# EAGLE design m8-usb-i2c-smd (EAGLE 5.11)
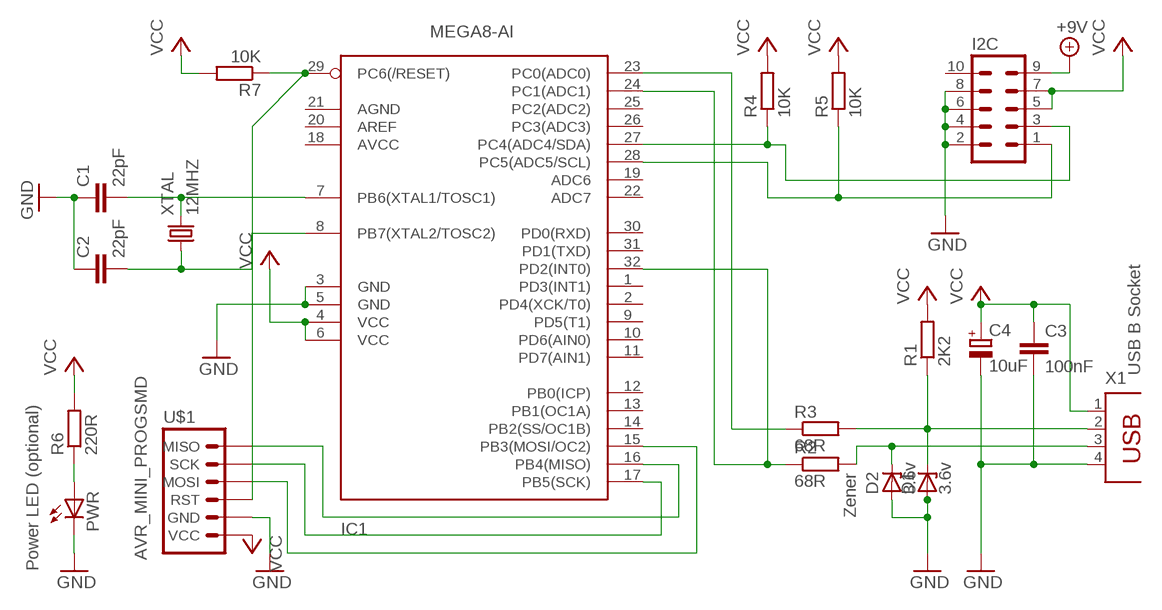
[diagram p0: schematic, sheet 1]

## Parts
C1  22pF  C-EUC1206  [C1206]
C2  22pF  C-EUC1206  [C1206]
C3  100nF  C-EUC1206  [C1206]
C4  10uF  CPOL-EUSMCC  [SMC_C]
D1  3.6v  ZENER-DIODESOT23  [SOT23]
D2  3.6v  ZENER-DIODESOT23  [SOT23]
I2C  ML10  [ML10]
IC1  MEGA8-AI  [TQFP32-08]
PWR  LEDCHIPLED_1206  [CHIPLED_1206]
R1  2K2  R-EU_R1206  [R1206]
R2  68R  R-EU_R1206  [R1206]
R3  68R  R-EU_R1206  [R1206]
R4  10K  R-EU_R1206  [R1206]
R5  10K  R-EU_R1206  [R1206]
R6  220R  R-EU_R1206  [R1206]
R7  10K  R-EU_R1206  [R1206]
U$1  AVR_MINI_PROGSMD  [AVR_MINI_PROG]
X1  PN61729  [PN61729]
XTAL  12MHZ  CRYSTALHC49S  [HC49/S]

## Nets
+9V: I2C.9
GND: C1.1 C2.1 C3.2 C4.- D1.1(A) D2.1(A) I2C.2 I2C.4 I2C.6 I2C.8 IC1.3(GND) IC1.5(GND) PWR.C U$1.2(GND) X1.4
MISO: IC1.16(PB4(MISO)) U$1.6(MISO)
MOSI: IC1.15(PB3(MOSI/OC2)) U$1.4(MOSI)
N$1: I2C.1 IC1.28(PC5(ADC5/SCL)) R5.1
N$2: D1.3(C) R1.1 R3.2 X1.2
N$3: IC1.29(PC6(/RESET)) R7.1 U$1.3(RST)
N$4: PWR.A R6.1
N$6: C2.2 IC1.8(PB7(XTAL2/TOSC2)) XTAL.1
N$7: C1.2 IC1.7(PB6(XTAL1/TOSC1)) XTAL.2
N$12: D2.3(C) R2.2 X1.3
SCL/SCK: IC1.17(PB5(SCK)) U$1.5(SCK)
SDA: I2C.3 IC1.27(PC4(ADC4/SDA)) R4.1
USB+: IC1.23(PC0(ADC0)) R3.1
USB-: IC1.24(PC1(ADC1)) IC1.32(PD2(INT0)) R2.1
VCC: C3.1 C4.+ I2C.5 I2C.7 IC1.4(VCC) IC1.6(VCC) R1.2 R4.2 R5.2 R6.2 R7.2 U$1.1(VCC) X1.1
Unconnected: I2C.10 IC1.1(PD3(INT1)) IC1.2(PD4(XCK/T0)) IC1.9(PD5(T1)) IC1.10(PD6(AIN0)) IC1.11(PD7(AIN1)) IC1.12(PB0(ICP)) IC1.13(PB1(OC1A)) IC1.14(PB2(SS/OC1B)) IC1.18(AVCC) IC1.19(ADC6) IC1.20(AREF) IC1.21(AGND) IC1.22(ADC7) IC1.25(PC2(ADC2)) IC1.26(PC3(ADC3)) IC1.30(PD0(RXD)) IC1.31(PD1(TXD))

## Notes on the sheet
- USB B Socket
- Zener
- Power LED (optional)

## Library data of the parts
C1-C3 = rcl:C-EU: CAPACITOR, European symbol
C4 = rcl:CPOL-EU: POLARIZED CAPACITOR, European symbol
D1 D2 = diode:ZENER-DIODE: Z-Diode
I2C = con-harting-ml:ML10: HARTING; OC_FARNELL: unknown; OC_NEWARK: unknown
IC1 = atmel:MEGA8: MICROCONTROLLER 8 Kbytes FLASH 1 kbytes SRAM 512 bytes EEPROM USART 6-channel 10 bit ADC 2-channel 8 bit ADC Source: avr.lbr
PWR = led:LED: LED OSRAM: - CHIPLED LG R971, LG N971, LY N971, LG Q971, LY Q971, LO R971, LY R971 LH N974, LH R974 LS Q976, LO Q976, LY Q976 LO Q996 - Hyper CHIPLED LW Q18S LB Q993, LB Q99A, LB R99A - SideLED LS A670, LO A670, LY A670, LG A670, LP A670 LB A673, LV A673, LT A673, LW A673 LH A674 LY A675 LS A676, LA A676, LO A676, LY A676, LW A676 LS A679, LY A679, LG A679 - Hyper Micro SIDELED® LS Y876, LA Y876, LO Y876, LY Y876 LT Y87S - SmartLED LW L88C, LW L88S LB L89C, LB L89S, LG L890 LS L89K, LO L89K, LY L89K LS L896, LA L896, LO L896, LY L896 - TOPLED LS T670, LO T670, LY T670, LG T670, LP T670 LSG T670, LSP T670, LSY T670, LOP T670, LYG T670 LG T671, LOG T671, LSG T671 LB T673, LV T673, LT T673, LW T673 LH T674 LS T676, LA T676, LO T676, LY T676, LB T676, LH T676, LSB T676, LW T676 LB T67C, LV T67C, LT T67C, LS T67K, LO T67K, LY T67K, LW E67C LS E67B, LA E67B, LO E67B, LY E67B, LB E67C, LV E67C, LT E67C LW T67C LS T679, LY T679, LG T679 LS T770, LO T770, LY T770, LG T770, LP T770 LB T773, LV T773, LT T773, LW T773 LH T774 LS E675, LA E675, LY E675, LS T675 LS T776, LA T776, LO T776, LY T776, LB T776 LHGB T686 LT T68C, LB T68C - Hyper Mini TOPLED® LB M676 - Mini TOPLED Santana® LG M470 LS M47K, LO M47K, LY M47K Source: http://www.osram.convergy.de - LUMILED® LXK2-PW12-R00, LXK2-PW12-S00, LXK2-PW14-U00, LXK2-PW14-V00 LXK2-PM12-R00, LXK2-PM12-S00, LXK2-PM14-U00 LXK2-PE12-Q00, LXK2-PE12-R00, LXK2-PE12-S00, LXK2-PE14-T00, LXK2-PE14-U00 LXK2-PB12-K00, LXK2-PB12-L00, LXK2-PB12-M00, LXK2-PB14-N00, LXK2-PB14-P00, LXK2-PB14-Q00 LXK2-PR12-L00, LXK2-PR12-M00, LXK2-PR14-Q00, LXK2-PR14-R00 LXK2-PD12-Q00, LXK2-PD12-R00, LXK2-PD12-S00 LXK2-PH12-R00, LXK2-PH12-S00 LXK2-PL12-P00, LXK2-PL12-Q00, LXK2-PL12-R00 Source: www.luxeon.com
R1-R7 = rcl:R-EU_: RESISTOR, European symbol
U$1 = SparkFun:AVR_MINI_PROG
X1 = con-berg:PN61729: BERG USB connector
XTAL = crystal:CRYSTAL: CRYSTAL

## Board
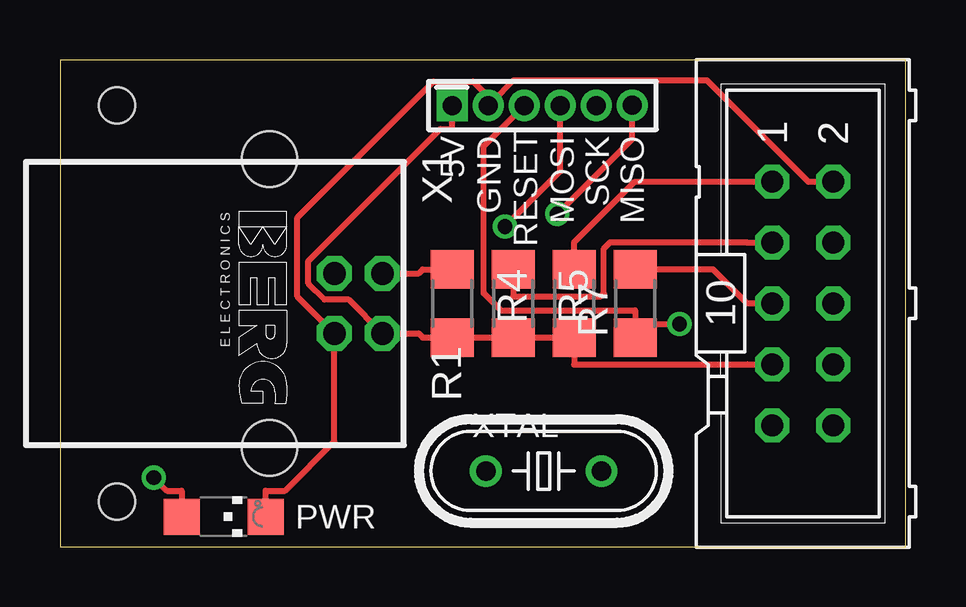
[diagram p1: board, top side]
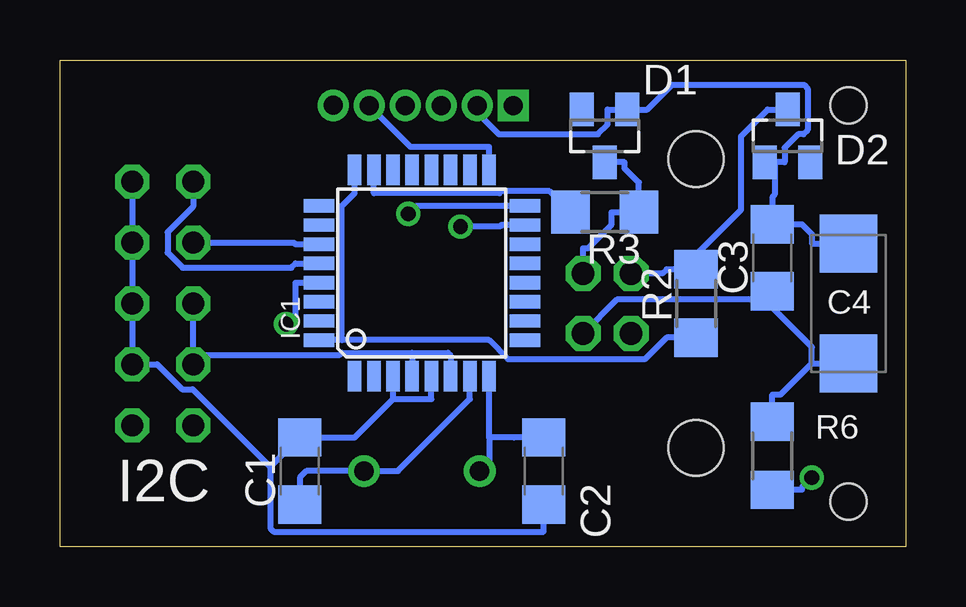
[diagram p2: board, bottom side, seen from below]

Size 35.23 x 20.31 mm. Coordinates in mm from the lower left corner, seen from the top.
Outline: 0,0 35.23,0 35.23,20.31 0,20.31 0,0
Copper layers (1*16): Top 0.035mm / dielectric 1.5mm / Bottom 0.035mm
Design rules "8mils": minimum track width 10mil, minimum drill 24mil, track to track 8mil, track to pad 8mil, pad to pad 8mil, via to via 8mil, smd to smd 8mil, copper to edge 40mil, drill to drill 10mil, minimum pad ring 10mil, minimum via ring 8mil, stop-mask expansion 0mil, vias tented up to drill 0mil, thermal gap 10mil
Holes 1.5 mm at 2.38,18.41 2.38,1.9

### Footprints (pad centres in the part's own frame; a part is rotated, then mirrored left to right if it is on the bottom)
C1206 = smd 1.6 x 1.8: 1 -1.4,0; 2 1.4,0
SMC_C = smd 2.4 x 2.4: + -2.5,0; - 2.5,0
SOT23 = smd 1 x 1.4: 1 -0.95,-1.1; 2 0.95,-1.1; 3 0,1.1
ML10 = drill 0.914 octagon: 1 -5.08,-1.27; 2 -5.08,1.27; 3 -2.54,-1.27; 4 -2.54,1.27; 5 0,-1.27; 6 0,1.27; 7 2.54,-1.27; 8 2.54,1.27; 9 5.08,-1.27; 10 5.08,1.27
TQFP32-08 = smd 1.27 x 0.559: 1 -4.293,2.8; 2 -4.293,2; 3 -4.293,1.2; 4 -4.293,0.4; 5 -4.293,-0.4; 6 -4.293,-1.2; 7 -4.293,-2; 8 -4.293,-2.8; 17 4.293,-2.8; 18 4.293,-2; 19 4.293,-1.2; 20 4.293,-0.4; 21 4.293,0.4; 22 4.293,1.2; 23 4.293,2; 24 4.293,2.8 | smd 0.559 x 1.27: 9 -2.8,-4.293; 10 -2,-4.293; 11 -1.2,-4.293; 12 -0.4,-4.293; 13 0.4,-4.293; 14 1.2,-4.293; 15 2,-4.293; 16 2.8,-4.293; 25 2.8,4.293; 26 2,4.293; 27 1.2,4.293; 28 0.4,4.293; 29 -0.4,4.293; 30 -1.2,4.293; 31 -2,4.293; 32 -2.8,4.293
CHIPLED_1206 = smd 1.5 x 1.5: A 0,-1.75; C 0,1.75
R1206 = smd 1.6 x 1.803: 1 -1.422,0; 2 1.422,0
AVR_MINI_PROG = drill 0.8 pad 1.27 square: 1 0,0 | drill 0.8 pad 1.27 round: 2 1.5,0; 3 3,0; 4 4.5,0; 5 6,0; 6 7.5,0.01
PN61729 = drill 0.95 octagon: 1 1.25,4.71; 2 -1.25,4.71; 3 -1.25,2.71; 4 1.25,2.71 | hole 2.3: -6.02,0; 6.02,0
HC49/S = drill 0.813 round: 1 -2.413,0; 2 2.413,0

### Placement (x,y rotation side)
C1  25.23,3.17 270 bottom
C2  15.08,3.17 90 bottom
C3  5.55,12.06 90 bottom
C4  2.38,10.15 90 bottom
D1  12.54,17.14 180 bottom
D2  4.92,17.14 0 bottom
I2C  30.95,10.15 270 top
IC1  20.16,11.42 90 bottom
PWR  6.82,1.27 270 top
R1  16.35,10.15 270 top
R2  8.73,10.15 90 bottom
R3  12.54,13.96 0 bottom
R4  18.89,10.15 270 top
R5  21.43,10.15 270 top
R6  5.55,3.81 90 bottom
R7  23.96,10.15 90 top
U$1  16.35,18.41 0 top
X1  8.73,10.15 270 top
XTAL  20.16,3.17 0 top

### Tracks (layer width: path | path; a pad name or v marks a point on that pad's centre or on a via)
GND
  Top 0.254: 18.02,18.59 U$1.2 | 18.02,18.59 18.89,19.46 26.96,19.46 31.18,15.23 I2C.2 | 18.02,18.59 17.21,19.4 15.56,19.4 9.89,13.74 9.89,10.45 X1.4 11.44,4.4 9.38,2.35 8.57,2.35 PWR.C
  Bottom 0.254: IC1.5 19.76,6.17 21.36,6.17 | 21.36,6.17 IC1.3 | 21.36,6.17 22.95,4.57 C1.1 26.46,3.34 | C2.1 15.08,0.64 26.33,0.64 26.46,0.78 26.46,3.34 | 26.46,3.34 29.7,6.57 30.14,6.57 31.18,7.62 I2C.8 I2C.6 I2C.4 I2C.2 | U$1.2 17.85,18.12 16.94,17.21 12.82,17.21 12.42,17.62 12.42,18.24 D1.1 10.76,18.24 9.72,19.27 4.23,19.27 4.08,19.12 4.08,17.39 4.25,17.21 4.47,17.21 5.04,16.65 5.04,16.04 5.45,16.04 | 5.45,16.04 5.45,14.69 5.55,14.59 C3.2 4.32,13.46 3.91,13.05 3.91,12.65 C4.- | 5.45,16.04 D2.1
MISO  (via drill 0.61 pad 1.02)
  Top 0.254: U$1.6 23.85,17.02 v20.72,13.89
  Bottom 0.254: IC1.16 20.39,14.22 v20.72,13.89
MOSI  (via drill 0.61 pad 1.02)
  Top 0.254: U$1.4 20.85,15.67 v18.54,13.36
  Bottom 0.254: IC1.15 16.83,13.42 16.89,13.36 v18.54,13.36
N$1
  Top 0.254: R5.1 21.43,12.71 23.95,15.23 I2C.1
  Bottom 0.254: IC1.28 25.41,11.82 25.59,11.65 30.12,11.65 30.74,12.28 30.74,13.13 29.68,14.19 I2C.1
N$2
  Top 0.254: R1.1 15.11,11.58 14.94,11.4 X1.2
  Bottom 0.254: X1.2 13.44,12.46 13.23,12.46 12.24,13.45 12.24,13.96 R3.2 11.11,15.2 11.71,15.79 11.71,16.04 D1.3
N$3  (via drill 0.61 pad 1.02)
  Top 0.254: 23.96,9.3 v25.81,9.3 | 23.96,9.3 23.96,9.86 18.38,9.86 17.65,10.59 17.65,16.72 U$1.3 | 23.96,9.3 R7.1
  Bottom 0.254: v25.81,9.3 25.41,9.69 25.41,11.02 IC1.29
N$4  (via drill 0.61 pad 1.02)
  Top 0.254: v3.91,2.9 4.46,2.35 5.07,2.35 PWR.A
  Bottom 0.254: R6.1 4.32,2.38 4.32,2.49 v3.91,2.9
N$6
  Bottom 0.254: 17.36,4.57 IC1.8 | XTAL.1 17.36,3.56 17.36,4.57 | 17.36,4.57 16.3,4.57 C2.2
N$7
  Bottom 0.254: IC1.7 18.16,6.17 21.15,3.17 XTAL.2 24.96,3.17 25.23,2.9 C1.2
N$12
  Bottom 0.254: D2.3 5.75,18.24 6.85,17.13 6.85,14.06 9.34,11.58 | 9.34,11.58 9.96,11.58 10.13,11.4 X1.3 | R2.2 9.34,11.58
SCL/SCK
  Bottom 0.254: IC1.17 17.36,16.68 20.62,16.68 U$1.5
SDA
  Top 0.254: I2C.3 28.64,12.69 28.63,12.71 22.92,12.71 22.66,12.44 22.66,10.57 22.53,10.45 18.89,10.45 R4.1
  Bottom 0.254: IC1.27 25.41,12.62 25.48,12.69 I2C.3
USB+
  Bottom 0.254: IC1.23 22.16,14.75 16.92,14.75 16.83,14.84 14.83,14.84 R3.1
USB-
  Bottom 0.254: R2.1 9.96,8.73 10.87,7.82 16.55,7.82 17.36,8.62 23.48,8.62 | IC1.24 22.96,14.75 23.48,14.22 23.48,8.62 | 23.48,8.62 IC1.32
VCC
  Top 0.254: I2C.5 28.64,10.15 27.22,11.58 R7.2 | I2C.7 28.64,7.62 28.63,7.6 21.43,7.6 R5.2 R4.2 R1.2 15.11,8.73 14.94,8.9 X1.1 12.02,10.32 11.03,10.32 10.35,10.99 10.35,11.93 15.85,17.43 16.35,17.43 U$1.1
  Bottom 0.254: R6.2 5.55,6.36 5.2,6.36 3.91,7.66 | 5.89,10.31 12.03,10.31 X1.1 | C3.1 5.89,10.31 | 5.89,10.31 3.91,8.33 3.91,7.66 | 3.91,7.66 C4.+ | 29.68,8.01 I2C.5 | I2C.7 29.68,8.01 | 29.68,8.01 23.57,8.01 23.48,8.1 20.55,8.1 | 20.55,8.1 IC1.4 | 20.55,8.1 19.07,8.1 18.96,7.98 IC1.6

### Text on the board
tNames: 5V | GND | RESET | MOSI | SCK | MISO